# EAGLE design button (EAGLE 6.5.0)
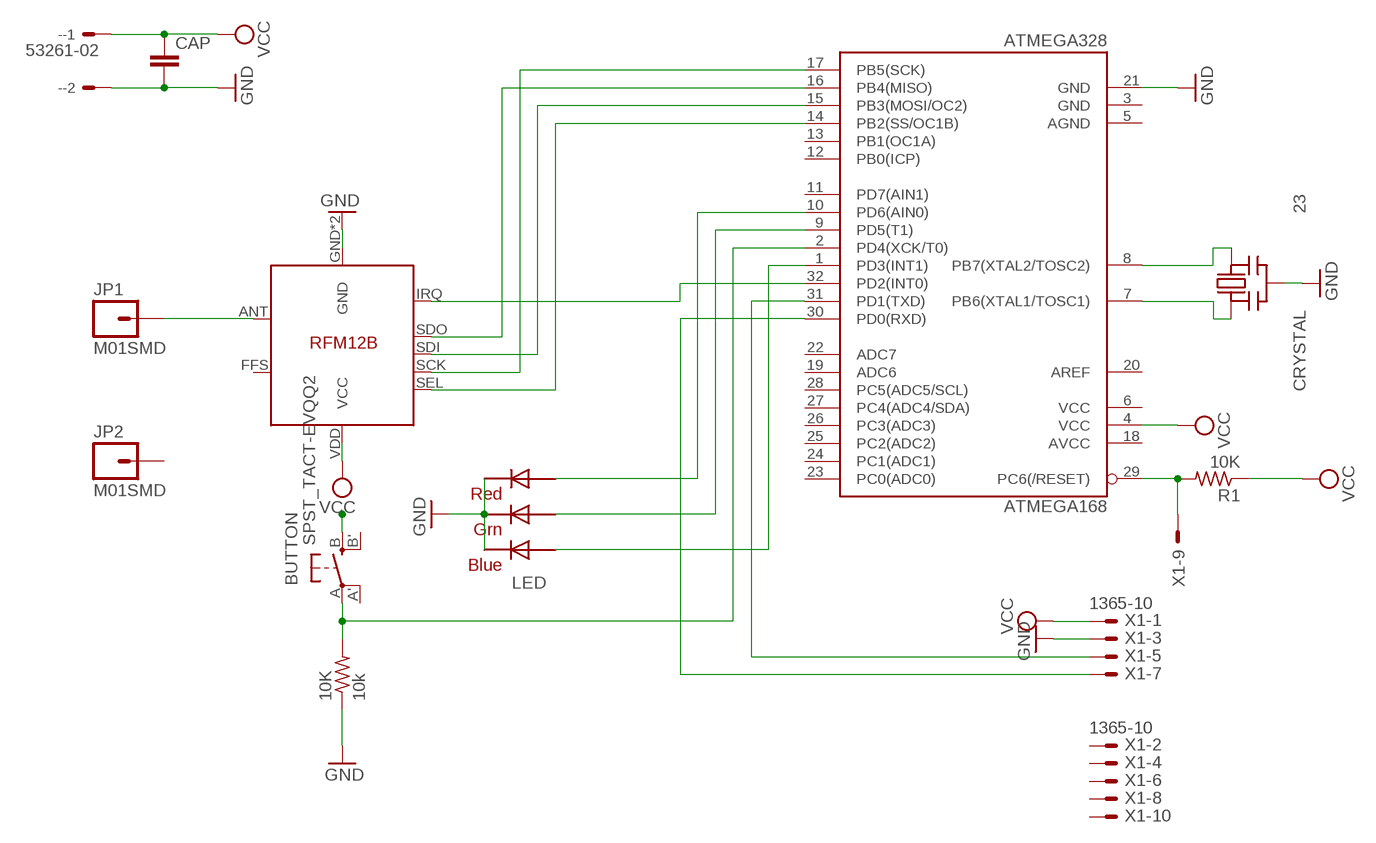
[diagram p0: schematic, sheet 1]

## Parts
10K  10k  R-US_R1206  [R1206]
-  53261-02  [53261-02]
ATMEGA328  ATMEGA168  [TQFP32-08]
BUTTON  SPST_TACT-EVQQ2  [EVQ-Q2]
CAP  CAP1206  [1206]
CRYSTAL  23  CERMOSCILL-CSTCRG  [CSTCR-G]
JP1  M01SMD  [LUXEON-PAD]
JP2  M01SMD  [LUXEON-PAD]
LED  RGBLED5050  [RGBLED5050]
R1  10K  R-US_R1206  [R1206]
RFM12B  RFM12B  RFM12BRMF12BGND  [RFM12B]
X1  1365-10  [1365-10]

## Nets
5V: -.1 ATMEGA328.4(VCC) BUTTON.B(S) CAP.1 R1.1 RFM12B.VDD(VCC) X1.1 ; supply symbol labelled VCC
BUTTON_PIN: 10K.2 ATMEGA328.2(PD4(XCK/T0)) BUTTON.A(P)
GND: 10K.1 -.2 ATMEGA328.21(GND) CAP.2 CRYSTAL.2(GND) LED.4(BLUE_C) LED.5(RED_C) LED.6(GREEN_C) RFM12B.GND RFM12B.P$12(GND) X1.3
N$11: ATMEGA328.8(PB7(XTAL2/TOSC2)) CRYSTAL.3(OUT)
N$17: ATMEGA328.17(PB5(SCK)) RFM12B.SCK
N$18: ATMEGA328.15(PB3(MOSI/OC2)) RFM12B.SDI
N$19: ATMEGA328.14(PB2(SS/OC1B)) RFM12B.SEL
N$21: ATMEGA328.16(PB4(MISO)) RFM12B.SDO
N$22: ATMEGA328.7(PB6(XTAL1/TOSC1)) CRYSTAL.1(IN)
N$23: ATMEGA328.1(PD3(INT1)) LED.3(BLUE_A)
N$24: ATMEGA328.32(PD2(INT0)) RFM12B.IRQ
N$25: JP1.P$1 RFM12B.ANT
N$26: ATMEGA328.10(PD6(AIN0)) LED.2(RED_A)
N$27: ATMEGA328.9(PD5(T1)) LED.1(GREEN_A)
N$28: ATMEGA328.31(PD1(TXD)) X1.5
N$32: ATMEGA328.30(PD0(RXD)) X1.7
NANE: ATMEGA328.29(PC6(/RESET)) R1.2 X1.9
Unconnected: ATMEGA328.3(GND) ATMEGA328.5(AGND) ATMEGA328.6(VCC) ATMEGA328.11(PD7(AIN1)) ATMEGA328.12(PB0(ICP)) ATMEGA328.13(PB1(OC1A)) ATMEGA328.18(AVCC) ATMEGA328.19(ADC6) ATMEGA328.20(AREF) ATMEGA328.22(ADC7) ATMEGA328.23(PC0(ADC0)) ATMEGA328.24(PC1(ADC1)) ATMEGA328.25(PC2(ADC2)) ATMEGA328.26(PC3(ADC3)) ATMEGA328.27(PC4(ADC4/SDA)) ATMEGA328.28(PC5(ADC5/SCL)) BUTTON.A'(P1) BUTTON.B'(S1) JP2.P$1 RFM12B.FFS X1.2 X1.4 X1.6 X1.8 X1.10

## Library data of the parts
10K R1 = adafruit:R-US_: RESISTOR, American symbol
- = con-molex:53?-02: CONNECTOR wire to board 1.25 mm (.049 inch) pitch header; OC_FARNELL: 1125373; OC_NEWARK: unknown
ATMEGA328 = SparkFun-DigitalIC:ATMEGA168: Atmel 32-pin 8-bit micro, 16k flash.
BUTTON = adafruit:SPST_TACT: SMT 6mm switch, EVQQ2 series http://www.ladyada.net/library/eagle
CAP = SparkFun:CAP: Capacitor Standard 0603 ceramic capacitor, and 0.1" leaded capacitor.
CRYSTAL = adafruit:CERMOSCILL: Ceramic oscillator with built in capacitors such as ZTT-12MHz http://www.ladyada.net/library/eagle
JP1 JP2 = SparkFun:M01: Header 1 Standard 1-pin 0.1" header. Use with straight break away headers (SKU : PRT-00116), right angle break away headers (PRT-00553), swiss pins (PRT-00743), machine pins (PRT-00117), and female headers (PRT-00115).
LED = adafruit:RGBLED: For 5050 RGB LEDs, the order of the LEDs may vary from one manufacturer to another!
RFM12B = JeeParts:RFM12B: GND pins connected
X1 = con-leotronics:1365-10: DUAL ROW STRAIGHT HEADER 1364 SERIES. 1.27mm x 1.27mm. Without Fixing Post. SMT Source: http://www.leotronics.co.uk/Conexcon/Data%20Sheets/sec.%20A/1364ing.pdf; OC_FARNELL: unknown; OC_NEWARK: unknown

## Board
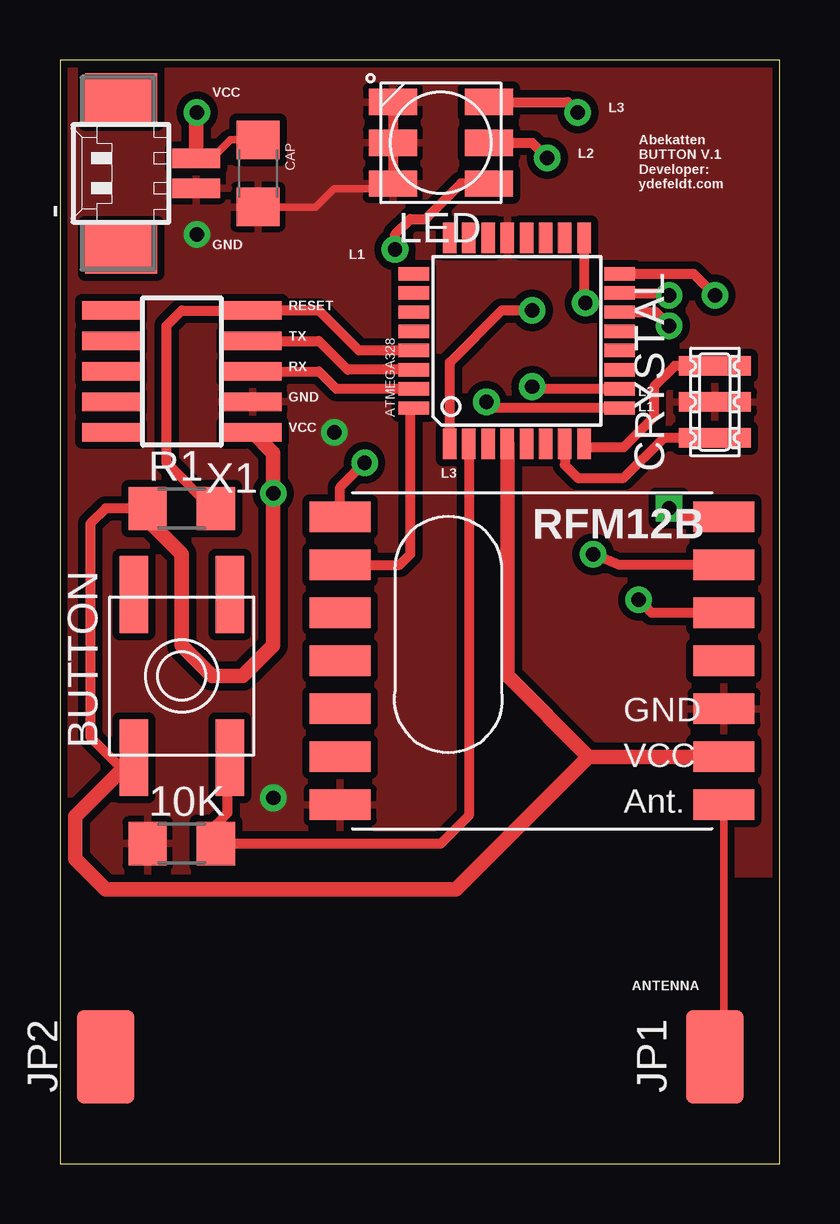
[diagram p1: board, top side]
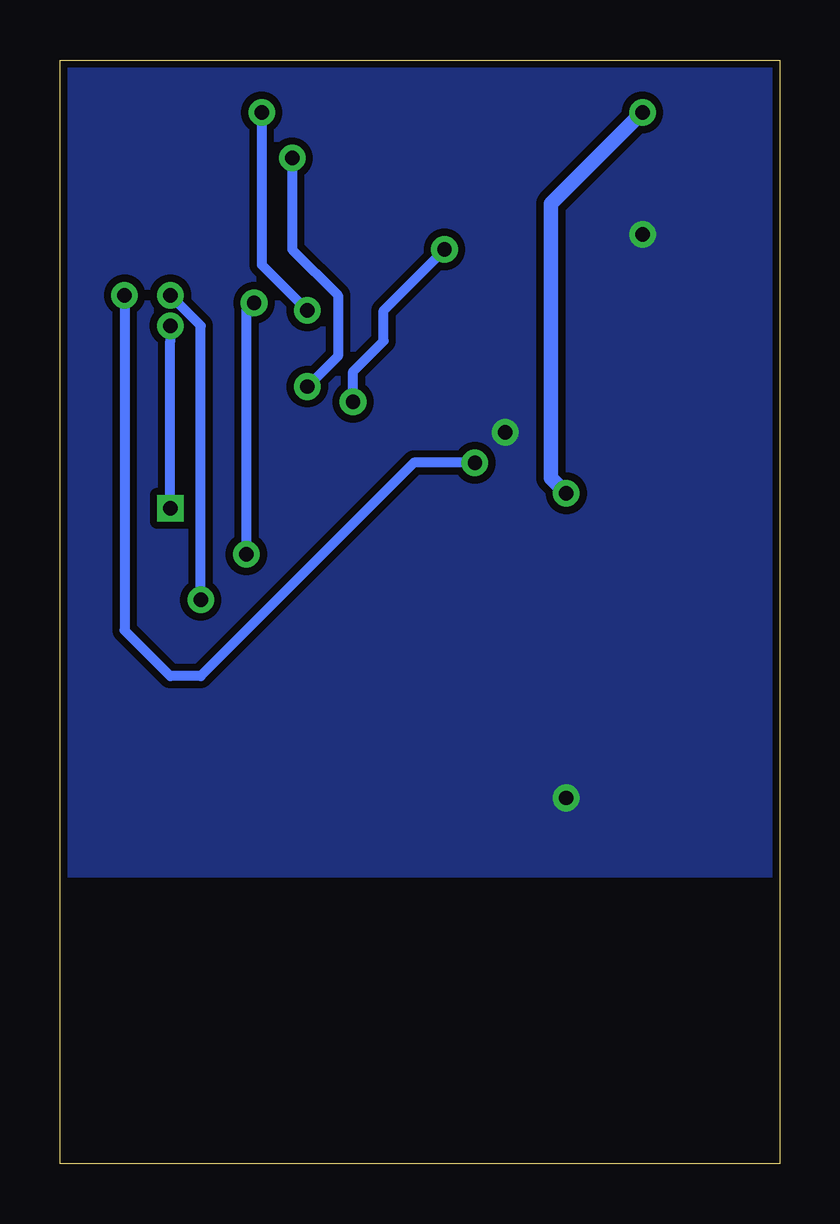
[diagram p2: board, bottom side, seen from below]

Size 30 x 46 mm. Coordinates in mm from the lower left corner, seen from the top.
Outline: 0,0 30,0 30,46 0,46 0,0
Copper layers (1*16): Top 0.035mm / dielectric 1.5mm / Bottom 0.035mm
Design rules "SparkFun": minimum track width 8mil, minimum drill 20mil, track to track 8mil, track to pad 8mil, pad to pad 8mil, via to via 8mil, smd to smd 8mil, copper to edge 10mil, drill to drill 8mil, minimum pad ring 12mil, minimum via ring 10mil, stop-mask expansion 4mil, vias tented up to drill 25mil, thermal gap 10mil

### Footprints (pad centres in the part's own frame; a part is rotated, then mirrored left to right if it is on the bottom)
R1206 = smd 1.6 x 1.803: 1 -1.422,0; 2 1.422,0
53261-02 = smd 0.8 x 2: 1 0.625,-2.5; 2 -0.625,-2.5 | smd 2.1 x 3: S1 3.125,0.625; S2 -3.125,0.625
TQFP32-08 = smd 1.27 x 0.559: 1 -4.293,2.8; 2 -4.293,2; 3 -4.293,1.2; 4 -4.293,0.4; 5 -4.293,-0.4; 6 -4.293,-1.2; 7 -4.293,-2; 8 -4.293,-2.8; 17 4.293,-2.8; 18 4.293,-2; 19 4.293,-1.2; 20 4.293,-0.4; 21 4.293,0.4; 22 4.293,1.2; 23 4.293,2; 24 4.293,2.8 | smd 0.559 x 1.27: 9 -2.8,-4.293; 10 -2,-4.293; 11 -1.2,-4.293; 12 -0.4,-4.293; 13 0.4,-4.293; 14 1.2,-4.293; 15 2,-4.293; 16 2.8,-4.293; 25 2.8,4.293; 26 2,4.293; 27 1.2,4.293; 28 0.4,4.293; 29 -0.4,4.293; 30 -1.2,4.293; 31 -2,4.293; 32 -2.8,4.293
EVQ-Q2 = smd 3.2 x 1.2: A -3.4,-2; A' 3.4,-2; B -3.4,2; B' 3.4,2
1206 = smd 1.6 x 1.8: 1 -1.4,0; 2 1.4,0
CSTCR-G = smd 0.8 x 3: 1 -1.5,0; 2 0,0; 3 1.5,0
LUXEON-PAD = smd 3.9 x 2.4: P$1 0,0
RGBLED5050 = smd 2 x 1.1: 1 -2,1.7; 2 -2,0; 3 -2,-1.7; 4 2,-1.7; 5 2,0; 6 2,1.7
RFM12B = smd 2.54 x 1.27: ANT 8,-6; FFS -8,2; GND 8,-2; IRQ -8,4; P$8 -8,0; P$9 -8,-2; P$10 -8,-4; P$12 -8,-6; P$16 8,0; SCK 8,4; SDI 8,2; SDO -8,6; SEL 8,6; VDD 8,-4
1365-10 = smd 0.76 x 2.4: 1 -2.54,-2.95; 2 -2.54,2.95; 3 -1.27,-2.95; 4 -1.27,2.95; 5 0,-2.95; 6 0,2.95; 7 1.27,-2.95; 8 1.27,2.95; 9 2.54,-2.95; 10 2.54,2.95

### Placement (x,y rotation side)
10K  5.08,13.34 0 top
-  3.17,41.27 90 top
ATMEGA328  19.05,34.29 90 top
BUTTON  5.08,20.32 90 top
CAP  8.26,41.27 270 top
CRYSTAL  27.3,31.75 90 top
JP1  27.3,4.45 90 top
JP2  1.91,4.45 90 top
LED  15.88,42.55 180 top
R1  5.08,27.3 0 top
RFM12B  19.68,20.95 0 top
X1  5.08,33.02 90 top

### Tracks (layer width: path | path; a pad name or v marks a point on that pad's centre or on a via)
5V  (via drill 0.6)
  Top 0.305: CAP.1 7.12,42.67 6.35,41.91 5.68,41.91 -.1
  Top 0.406: R1.1 1.91,27.3 1.27,26.67 1.27,17.78 2.54,16.51 2.67,16.51 BUTTON.B
  Top 0.61: v5.71,43.81 5.67,43.77 -.1 | X1.1 8.89,29.62 v8.89,27.94 8.89,21.59 7.62,20.32 6.35,20.32 5.08,21.59 5.08,25.4 3.66,26.82 R1.1 | RFM12B.VDD 22.04,16.95 | 22.04,16.95 16.51,11.43 1.91,11.43 0.64,12.7 0.64,14.47 2.67,16.51 | ATMEGA328.4 18.65,20.34 22.04,16.95
  Bottom 0.61: v5.71,43.81 9.53,40.01 9.53,28.57 v8.89,27.94
BUTTON_PIN
  Top 0.406: ATMEGA328.2 17.05,14.51 15.88,13.34 10K.2 6.5,14.12 6.99,14.61 6.99,16.82 BUTTON.A
GND  (via drill 0.6)
  Top 0.305: CAP.2 10.66,39.88 11.43,40.64 13.97,40.64
  Top 0.406: LED.4 LED.5 LED.6
  other vias: 5.71,38.73 11.43,30.48 8.89,15.24
  pour Bottom (isolate 0.305): 0,45.72 29.84,45.72 29.84,12.06 0,12.06
  pour Top (isolate 0.305): 0,45.72 29.84,45.72 29.84,12.06 0,12.06
N$11
  Top 0.406: 26.9,33.25 25.63,33.25 24.77,32.38 24.77,31.11 23.5,29.84 22,29.84 ATMEGA328.8 | CRYSTAL.3 26.9,33.25 | 26.9,33.25 26.67,33.02
N$17  (via drill 0.6)
  Top 0.406: RFM12B.SCK 23.3,24.95 v22.23,25.4 | ATMEGA328.17 21.85,35.94 v21.91,35.88
  Bottom 0.406: v22.23,25.4 22.23,35.56 v21.91,35.88
N$18  (via drill 0.6)
  Top 0.406: RFM12B.SDI 24.67,22.95 v24.13,23.5 | ATMEGA328.15 25.3,36.29 v25.4,36.2
  Bottom 0.406: v24.13,23.5 24.13,34.92 v25.4,36.2
N$19  (via drill 0.6)
  Top 0.406: RFM12B.SEL 25.75,26.95 v25.4,27.3 | ATMEGA328.14 24.84,35.49 v25.4,34.92
  Bottom 0.406: v25.4,27.3 25.4,34.29 v25.4,34.92
N$21  (via drill 0.6)
  Top 0.406: RFM12B.SDO 11.69,28.2 v12.7,29.21 | ATMEGA328.16 26.41,37.09 v27.3,36.2
  Bottom 0.406: v12.7,29.21 15.24,29.21 24.13,20.32 25.4,20.32 27.3,22.23 v27.3,36.2
N$22
  Top 0.406: ATMEGA328.7 21.05,29.11 21.59,28.57 23.5,28.57 25.17,30.25 CRYSTAL.1
N$23  (via drill 0.6)
  Top 0.406: LED.3 21.16,44.24 v21.59,43.81 | v19.68,35.56 18.41,35.56 16.25,33.4 ATMEGA328.1
  Bottom 0.406: v21.59,43.81 21.59,37.47 v19.68,35.56
N$24
  Top 0.406: RFM12B.IRQ 14.16,24.95 14.61,25.4 14.61,31.34 ATMEGA328.32
N$25
  Top 0.305: JP1.P$1 27.68,4.45 RFM12B.ANT
N$26  (via drill 0.6)
  Top 0.406: LED.2 19.68,42.55 v20.32,41.91 | ATMEGA328.10 19.78,32.29 v19.68,32.38
  Bottom 0.406: v20.32,41.91 20.32,38.1 18.41,36.2 18.41,33.66 v19.68,32.38
N$27  (via drill 0.6)
  Top 0.406: ATMEGA328.9 18.04,31.49 v17.78,31.75 | v13.97,38.1 13.97,38.73 14.61,39.37 15.24,39.37 16.71,40.84 LED.1
  Bottom 0.406: v17.78,31.75 17.78,33.02 16.51,34.29 16.51,35.56 v13.97,38.1
N$28
  Top 0.406: X1.5 10.79,33.02 11.53,32.29 ATMEGA328.31
N$32
  Top 0.406: X1.7 10.79,34.29 11.99,33.09 ATMEGA328.30
NANE
  Top 0.406: ATMEGA328.29 12.46,33.89 10.79,35.56 X1.9 5.08,35.56 4.45,34.92 4.45,29.21 6.35,27.3 R1.2

### Text on the board
_tsilk: VCC | L3 | L2 | Abekatten / BUTTON V.1 / Developer: / ydefeldt.com | GND | L1 | RESET | TX | RX | GND | L1 | L2 | VCC | L3 | ANTENNA